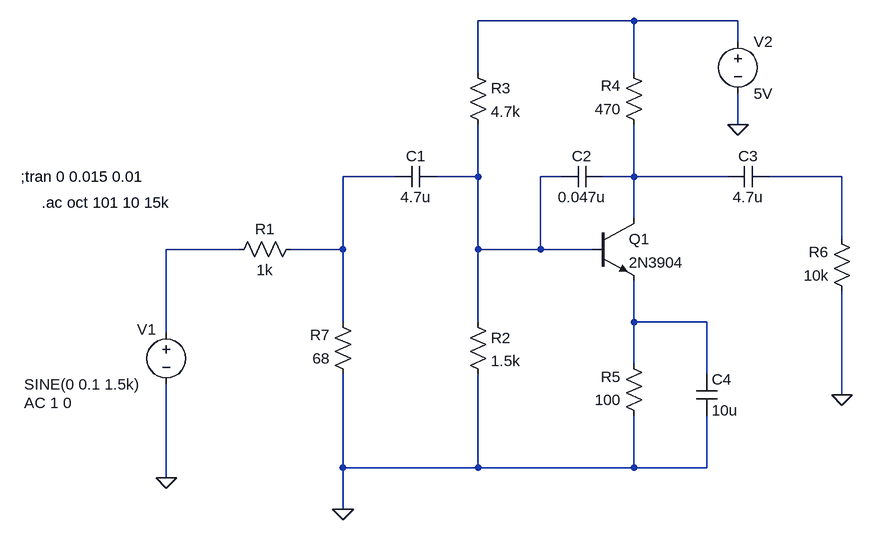
[diagram p0: schematic m2k_denryukikan.asc]
m2k_denryukikan.asc, the LTspice schematic file:
Version 4
SHEET 1 984 680
WIRE 384 -256 144 -256
WIRE 544 -256 384 -256
WIRE 544 -224 544 -256
WIRE 144 -176 144 -256
WIRE 384 -176 384 -256
WIRE 544 -96 544 -144
WIRE 16 -16 -64 -16
WIRE 144 -16 144 -96
WIRE 144 -16 80 -16
WIRE 272 -16 240 -16
WIRE 384 -16 384 -96
WIRE 384 -16 336 -16
WIRE 528 -16 384 -16
WIRE 704 -16 592 -16
WIRE 384 48 384 -16
WIRE 704 80 704 -16
WIRE -224 96 -336 96
WIRE -64 96 -64 -16
WIRE -64 96 -144 96
WIRE 144 96 144 -16
WIRE 240 96 240 -16
WIRE 240 96 144 96
WIRE 320 96 240 96
WIRE -64 208 -64 96
WIRE 144 208 144 96
WIRE 384 208 384 144
WIRE 496 208 384 208
WIRE -336 224 -336 96
WIRE 384 272 384 208
WIRE 496 288 496 208
WIRE 704 320 704 160
WIRE -64 432 -64 288
WIRE 144 432 144 288
WIRE 144 432 -64 432
WIRE 384 432 384 352
WIRE 384 432 144 432
WIRE 496 432 496 352
WIRE 496 432 384 432
WIRE -336 448 -336 304
WIRE -64 496 -64 432
FLAG -64 496 0
FLAG 704 320 0
FLAG -336 448 0
FLAG 544 -96 0
SYMBOL npn 320 48 R0
SYMATTR InstName Q1
SYMATTR Value 2N3904
SYMBOL res -128 80 R90
WINDOW 0 0 56 VBottom 2
WINDOW 3 32 56 VTop 2
SYMATTR InstName R1
SYMATTR Value 1k
SYMBOL res -48 304 R180
WINDOW 0 36 76 Left 2
WINDOW 3 36 40 Left 2
SYMATTR InstName R7
SYMATTR Value 68
SYMBOL res 400 -80 R180
WINDOW 0 36 76 Left 2
WINDOW 3 36 40 Left 2
SYMATTR InstName R4
SYMATTR Value 470
SYMBOL res 400 368 R180
WINDOW 0 36 76 Left 2
WINDOW 3 36 40 Left 2
SYMATTR InstName R5
SYMATTR Value 100
SYMBOL res 720 176 R180
WINDOW 0 36 76 Left 2
WINDOW 3 36 40 Left 2
SYMATTR InstName R6
SYMATTR Value 10k
SYMBOL cap 336 -32 R90
WINDOW 0 0 32 VBottom 2
WINDOW 3 32 32 VTop 2
SYMATTR InstName C2
SYMATTR Value 0.047u
SYMBOL cap 528 0 R270
WINDOW 0 32 32 VTop 2
WINDOW 3 0 32 VBottom 2
SYMATTR InstName C3
SYMATTR Value 4.7u
SYMBOL voltage -336 208 R0
WINDOW 0 -45 11 Left 2
WINDOW 3 -219 96 Left 2
WINDOW 123 -219 124 Left 2
WINDOW 39 0 0 Left 0
SYMATTR InstName V1
SYMATTR Value SINE(0 0.1 1.5k)
SYMATTR Value2 AC 1 0
SYMBOL voltage 544 -240 R0
WINDOW 123 0 0 Left 0
WINDOW 39 0 0 Left 0
SYMATTR InstName V2
SYMATTR Value 5V
SYMBOL res 128 192 R0
SYMATTR InstName R2
SYMATTR Value 1.5k
SYMBOL res 128 -192 R0
SYMATTR InstName R3
SYMATTR Value 4.7k
SYMBOL cap 80 -32 R90
WINDOW 0 0 32 VBottom 2
WINDOW 3 32 32 VTop 2
SYMATTR InstName C1
SYMATTR Value 4.7u
SYMBOL cap 480 288 R0
SYMATTR InstName C4
SYMATTR Value 10u
TEXT -560 -16 Left 2 !;tran 0 0.015 0.01
TEXT -528 24 Left 2 !.ac oct 101 10 15k

The netlist it stands for:
* m2k_denryukikan.asc
Q1 N004 N003 N007 0 2N3904
R1 N002 N006 1k
R7 0 N002 68
R4 N004 N001 470
R5 0 N007 100
R6 0 N005 10k
C2 N004 N003 0.047u
C3 N004 N005 4.7u
V1 N006 0 SINE(0 0.1 1.5k) AC 1 0
V2 N001 0 5V
R2 N003 0 1.5k
R3 N001 N003 4.7k
C1 N003 N002 4.7u
C4 N007 0 10u
.model NPN NPN
.model PNP PNP
.lib standard.bjt
;tran 0 0.015 0.01
.ac oct 101 10 15k
.backanno
.end